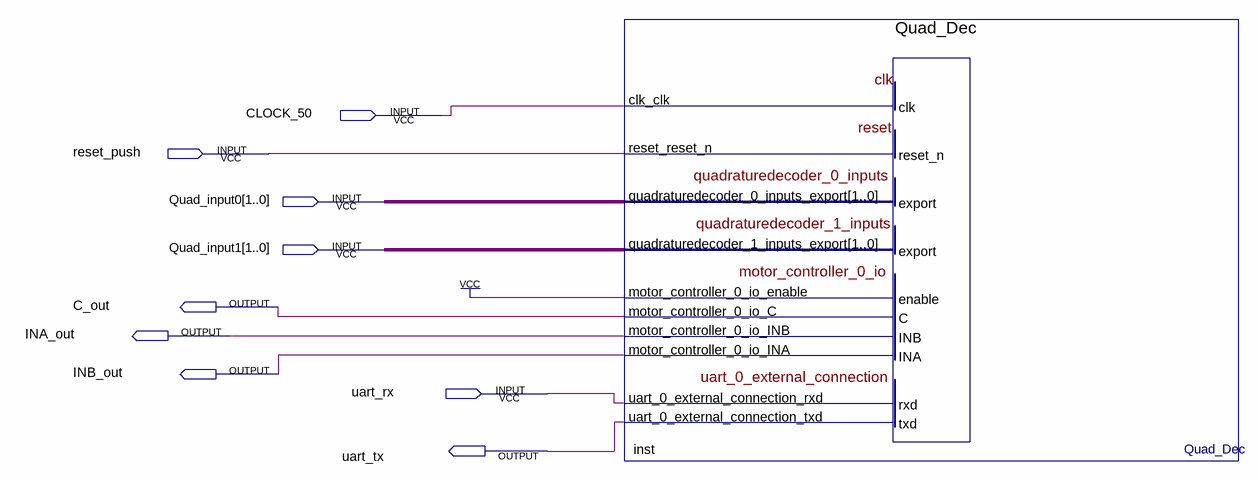
[diagram p0: schematic sheet]
// Quartus schematic esl_as4.bdf as structural Verilog: 1 symbols, 9 pins
module esl_as4 (
  input  CLOCK_50,
  input  reset_push,
  input  [1:0] Quad_input0,
  input  [1:0] Quad_input1,
  input  uart_rx,
  output C_out,
  output INA_out,
  output INB_out,
  output uart_tx
);

  Quad_Dec inst (
    .clk_clk(CLOCK_50), .reset_reset_n(reset_push), .quadraturedecoder_0_inputs_export(Quad_input0),
    .quadraturedecoder_1_inputs_export(Quad_input1), .motor_controller_0_io_enable(1'b1),
    .uart_0_external_connection_rxd(uart_rx), .motor_controller_0_io_C(C_out),
    .motor_controller_0_io_INB(INA_out), .motor_controller_0_io_INA(INB_out),
    .uart_0_external_connection_txd(uart_tx));
endmodule
